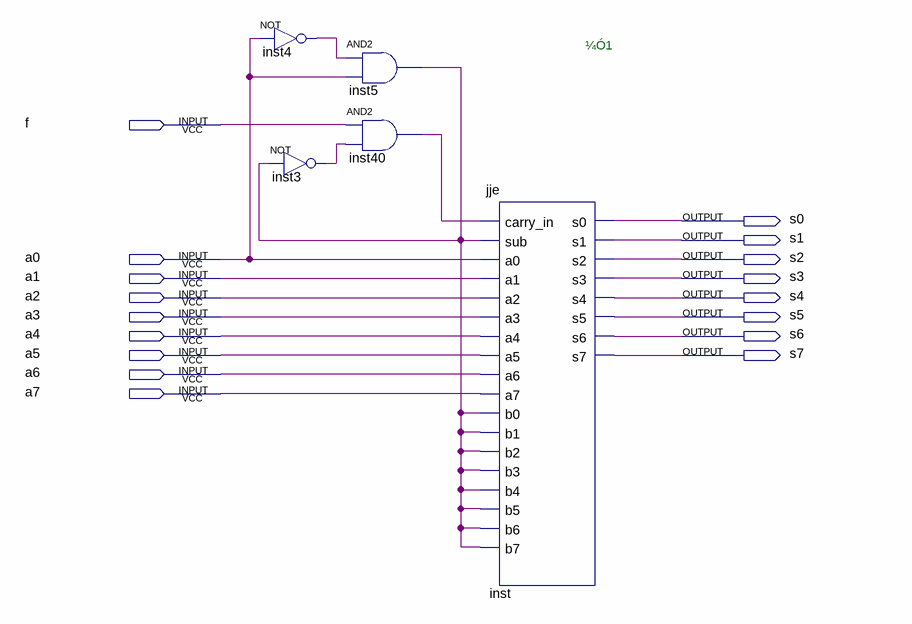
[diagram p0: schematic sheet]
// Quartus schematic jia1.bdf as structural Verilog: 5 symbols, 17 pins
module jia1 (
  input  f,
  input  a0,
  input  a1,
  input  a2,
  input  a3,
  input  a4,
  input  a5,
  input  a6,
  input  a7,
  output s0,
  output s1,
  output s2,
  output s3,
  output s4,
  output s5,
  output s6,
  output s7
);

  wire inst3_out, inst4_out, inst5_out, inst40_out;

  not inst4 (inst4_out, a0);
  not inst3 (inst3_out, inst5_out);
  and inst5 (inst5_out, inst4_out, a0);
  and inst40 (inst40_out, f, inst3_out);
  jje inst (
    .carry_in(inst40_out), .sub(inst5_out), .a0(a0), .a1(a1), .a2(a2), .a3(a3), .a4(a4), .a5(a5), .a6(a6),
    .a7(a7), .b0(inst5_out), .b1(inst5_out), .b2(inst5_out), .b3(inst5_out), .b4(inst5_out), .b5(inst5_out),
    .b6(inst5_out), .b7(inst5_out), .s0(s0), .s1(s1), .s2(s2), .s3(s3), .s4(s4), .s5(s5), .s6(s6), .s7(s7));

  // Notes on the sheet:
  //   ¼Ó1
endmodule
